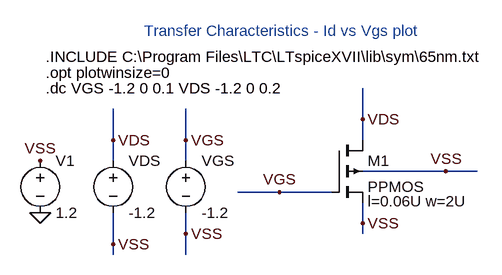
[diagram p0: schematic 5Transfer Characteristics - Id vs Vgs plot pmos.asc]
5Transfer Characteristics - Id vs Vgs plot pmos.asc, the LTspice schematic file:
Version 4
SHEET 1 880 680
WIRE 272 48 272 0
WIRE -112 80 -112 32
WIRE 0 80 0 32
WIRE 272 80 272 48
WIRE -112 112 -112 80
WIRE 0 112 0 80
WIRE 400 128 272 128
WIRE 448 128 400 128
WIRE 144 160 80 160
WIRE 224 160 144 160
WIRE 272 208 272 176
WIRE 0 224 0 192
WIRE 272 224 272 208
WIRE -112 240 -112 192
WIRE -112 256 -112 240
WIRE 0 256 0 224
FLAG 144 160 VGS
FLAG 0 80 VGS
FLAG 272 48 VDS
FLAG -112 80 VDS
FLAG -224 112 VSS
FLAG 272 208 VSS
FLAG 400 128 VSS
FLAG -224 192 0
FLAG -112 240 VSS
FLAG 0 224 VSS
SYMBOL voltage -112 96 R0
SYMATTR InstName VDS
SYMATTR Value -1.2
SYMBOL voltage 0 96 R0
WINDOW 123 0 0 Left 0
WINDOW 39 0 0 Left 0
SYMATTR InstName VGS
SYMATTR Value -1.2
SYMBOL pmos4 224 80 R0
WINDOW 123 56 94 Left 2
SYMATTR InstName M1
SYMATTR Value PPMOS
SYMATTR Value2 l=0.06U w=2U
SYMBOL voltage -224 96 R0
SYMATTR InstName V1
SYMATTR Value 1.2
TEXT -216 -48 Left 2 !.INCLUDE C:\\Program Files\\LTC\\LTspiceXVII\\lib\\sym\\65nm.txt
TEXT -216 -24 Left 2 !.opt plotwinsize=0
TEXT -216 0 Left 2 !.dc VGS -1.2 0 0.1 VDS -1.2 0 0.2
TEXT -64 -88 Left 2 ;Transfer Characteristics - Id vs Vgs plot

The netlist it stands for:
* 5Transfer Characteristics - Id vs Vgs plot pmos.asc
VDS VDS VSS -1.2
VGS VGS VSS -1.2
M1 VDS VGS VSS VSS PPMOS l=0.06U w=2U
V1 VSS 0 1.2
.model NMOS NMOS
.model PMOS PMOS
.lib standard.mos
.INCLUDE C:\Program Files\LTC\LTspiceXVII\lib\sym\65nm.txt
.opt plotwinsize=0
.dc VGS -1.2 0 0.1 VDS -1.2 0 0.2
* Transfer Characteristics - Id vs Vgs plot
.backanno
.end